# EAGLE schematic LightBoard2 (EAGLE 9.5.0)
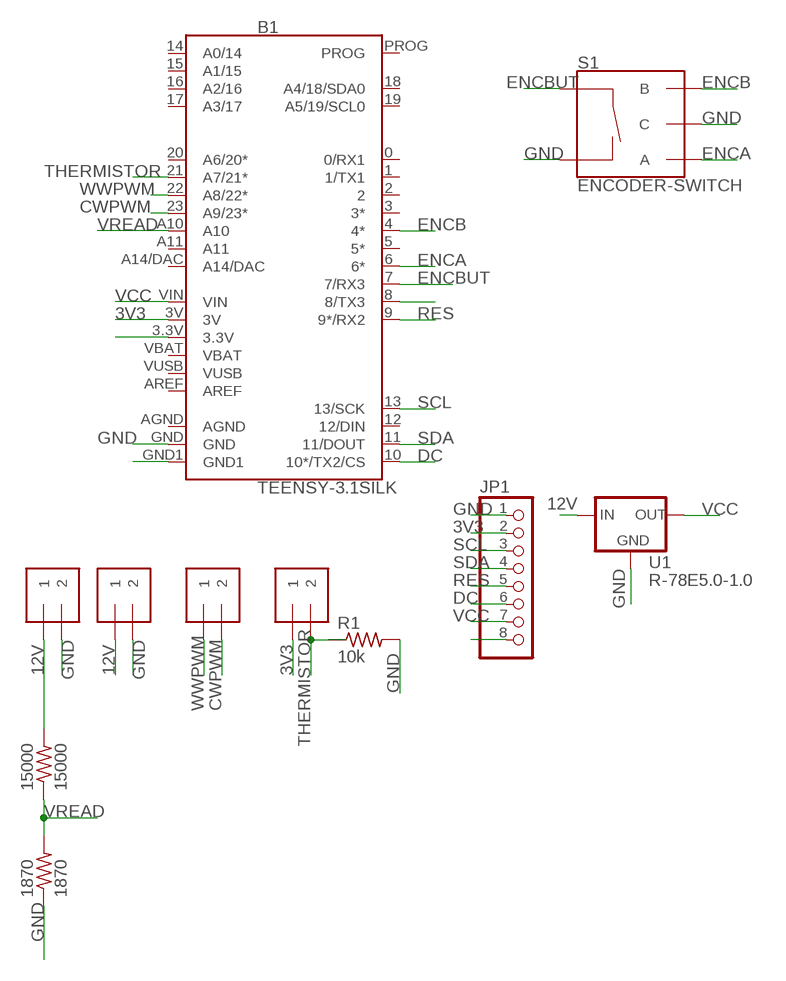
[diagram p0: schematic, sheet 1]

## Parts
1870  1870  R-US_0204/5  [0204/5]
15000  15000  R-US_0204/5  [0204/5]
B1  TEENSY-3.1SILK  [TEENSY-3.1]
J1  1X2-3.5MM  [1X2-3.5MM]
J2  1X2-3.5MM  [1X2-3.5MM]
J3  1X2-3.5MM  [1X2-3.5MM]
J5  1X2-3.5MM  [1X2-3.5MM]
JP1  PINHD-1X8LOCK  [1X08-LOCK]
R1  10k  R-US_0204/5  [0204/5]
S1  ENCODER-SWITCH  [ROTARY_ENC_PLAIN]
U1  R-78E5.0-1.0  [DC-DC_CONVERTER_78XX]

## Nets
3V3: B1.3V J3.1 JP1.2
12V: 15000.2 J2.1 J5.1 U1.VIN(IN)
CWPWM: B1.23(A9/23*) J1.2
DC: B1.10(10*/TX2/CS) JP1.6
ENCA: B1.6(6*) S1.A
ENCB: B1.4(4*) S1.B
ENCBUT: B1.7(7/RX3) S1.SW+
GND: 1870.1 B1.GND B1.GND1 J2.2 J5.2 JP1.1 R1.2 S1.C S1.SW- U1.GND
N$1: B1.3.3V
N$5: B1.8(8/TX3)
N$14: JP1.8
RES: B1.9(9*/RX2) JP1.5
SCL: B1.13(13/SCK) JP1.3
SDA: B1.11(11/DOUT) JP1.4
THERMISTOR: B1.21(A7/21*) J3.2 R1.1
VCC: B1.VIN JP1.7 U1.VOUT(OUT)
VREAD: 1870.2 15000.1 B1.A10
WWPWM: B1.22(A8/22*) J1.1
Unconnected: B1.0(0/RX1) B1.1(1/TX1) B1.2 B1.3(3*) B1.5(5*) B1.12(12/DIN) B1.14(A0/14) B1.15(A1/15) B1.16(A2/16) B1.17(A3/17) B1.18(A4/18/SDA0) B1.19(A5/19/SCL0) B1.20(A6/20*) B1.A11 B1.A14/DAC B1.AREF B1.PROG

## Power pins joined to a net without a drawn wire
AGND: B1.AGND
VBAT: B1.VBAT
VUSB: B1.VUSB

## Library data of the parts
1870 15000 R1 = adafruit:R-US_: RESISTOR, American symbol
B1 = SparkFun-Boards:TEENSY-3.1: Teensy 3+ Footprint Mechanical footprint with connectors for Teensy Development Board with ARM Cortex. SparkFun Products: Teensy 3.2 <https://www.sparkfun.com/products/13736> Teensy LC <https://www.sparkfun.com/products/13305>; SF_ID: DEV-12646
J1-J3 J5 = adafruit:1X2: 3.5mm Terminal block http://www.ladyada.net/library/pcb/eaglelibrary.html
JP1 = adafruit:PINHD-1X8: PIN HEADER
S1 = SparkFun-Switches:ENCODER-SWITCH: Rotary Encoder w/ Select Switch Encoders rotate similarly to potentiometers, but they’re different from potentiometers in that an encoder has full rotation without limits. They output gray code so that you can tell how much and in which direction the encoder has been turned. This encoder includes a push-down select switch built into the shaft. SparkFun Products Rotary Encoder <https://www.sparkfun.com/products/9117> (COM-09117); SF_SKU: COM-09117
U1 = SparkFun-IC-Power:R-78E5.0-1.0: Recom Power 5V 1A DC/DC Converter The Recom R-78E5.0-X.X is a compact DC/DC converter module that is a pin for pin drop-in replacement for the LM7805 linear voltage regulator. Specifications: Input Range: 7-28V Output Voltage: 5V Output Current: 1A Max Efficiency: 91% Datasheet <https://www.recom-power.com/pdf/Innoline/R-78Exx-1.0.pdf>; PROD_ID: COM-13655